# EAGLE design expander8 (EAGLE 6.1)
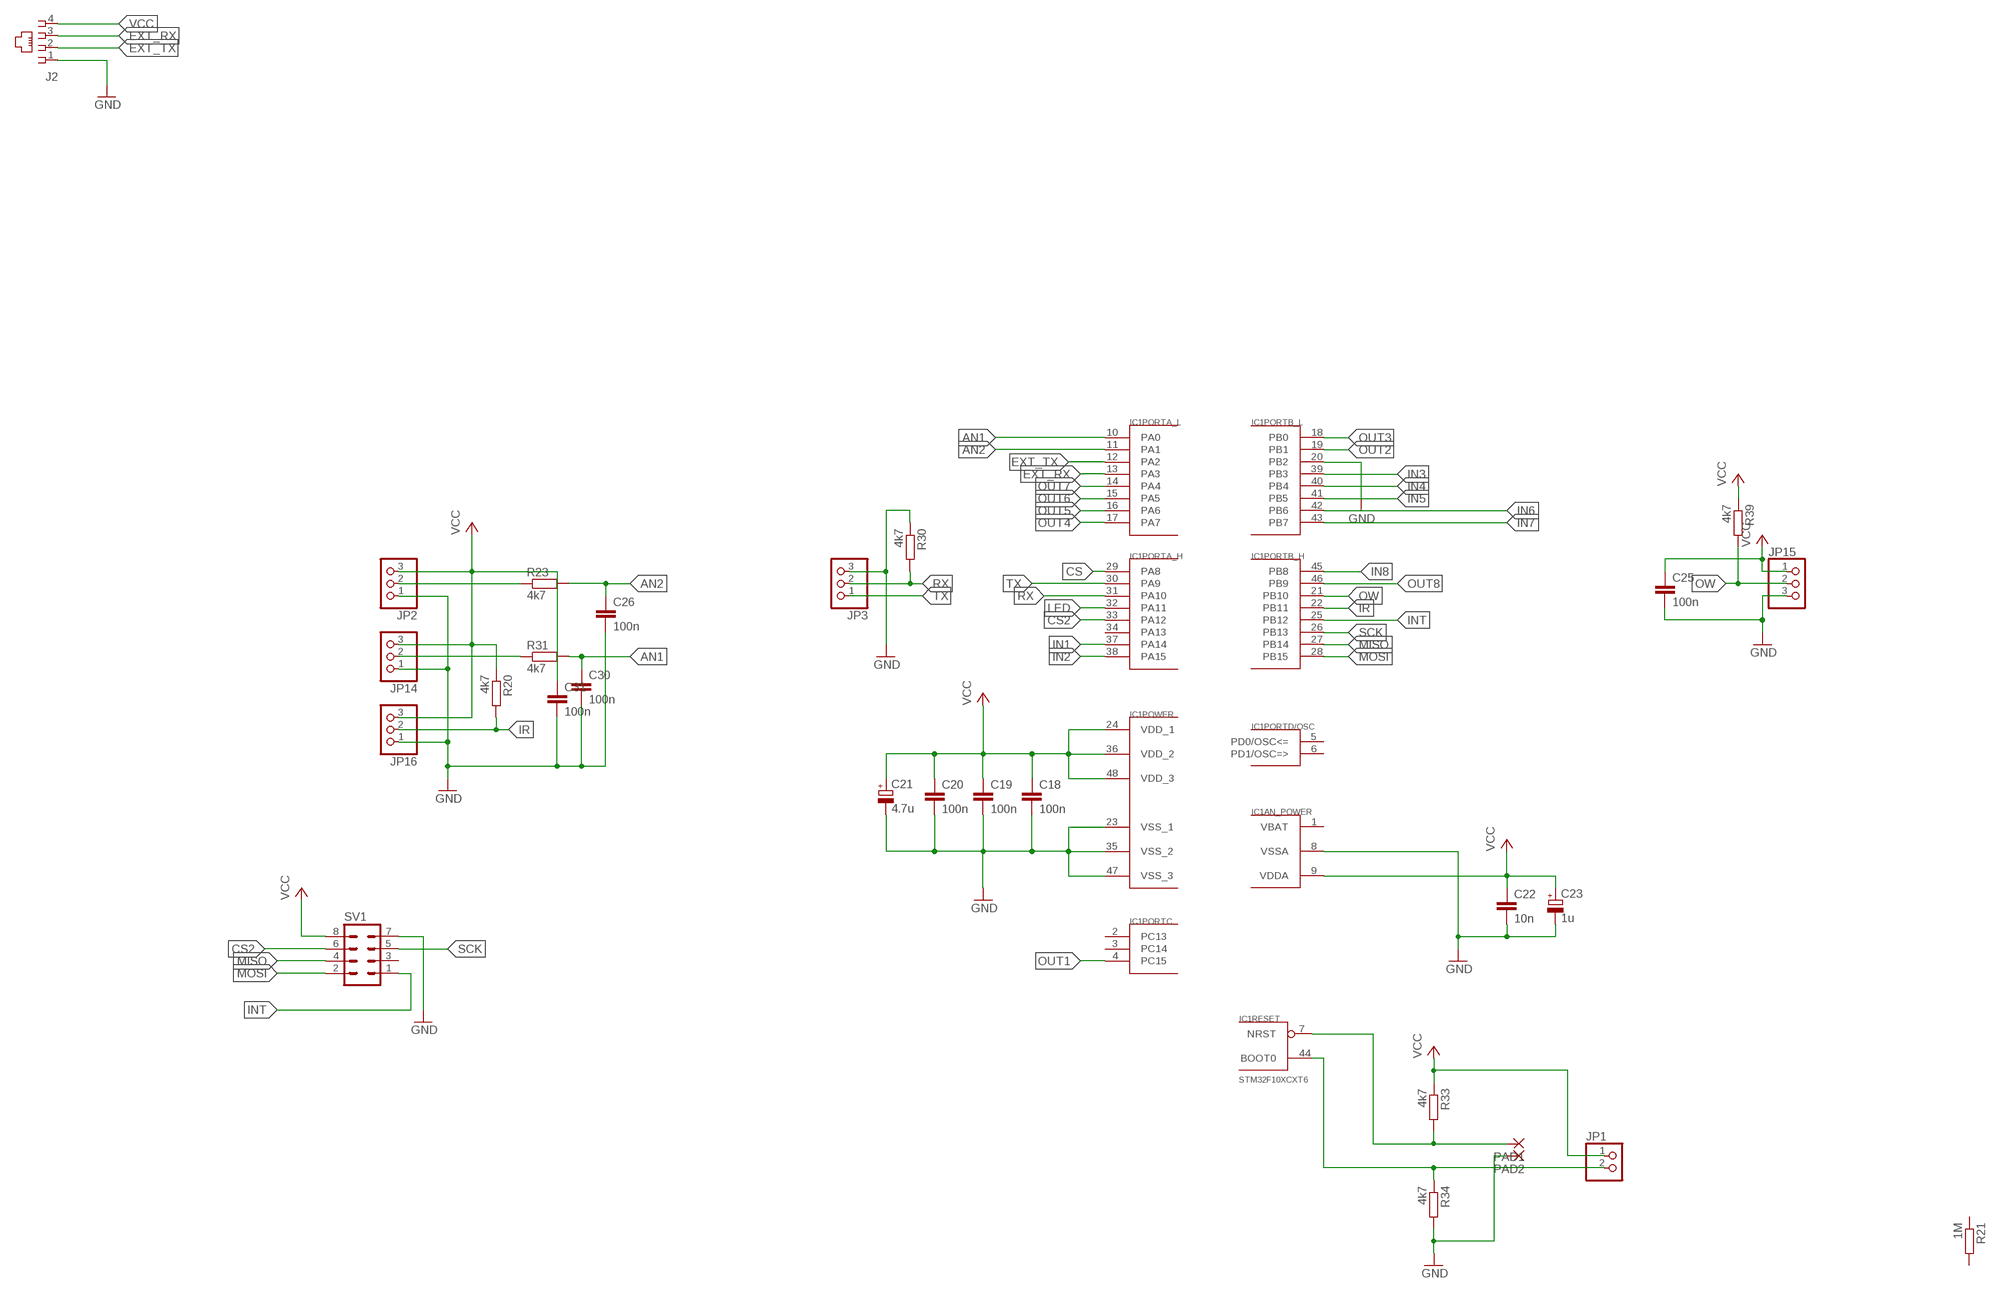
[diagram p0: schematic, sheet 1, part 1 of 3]
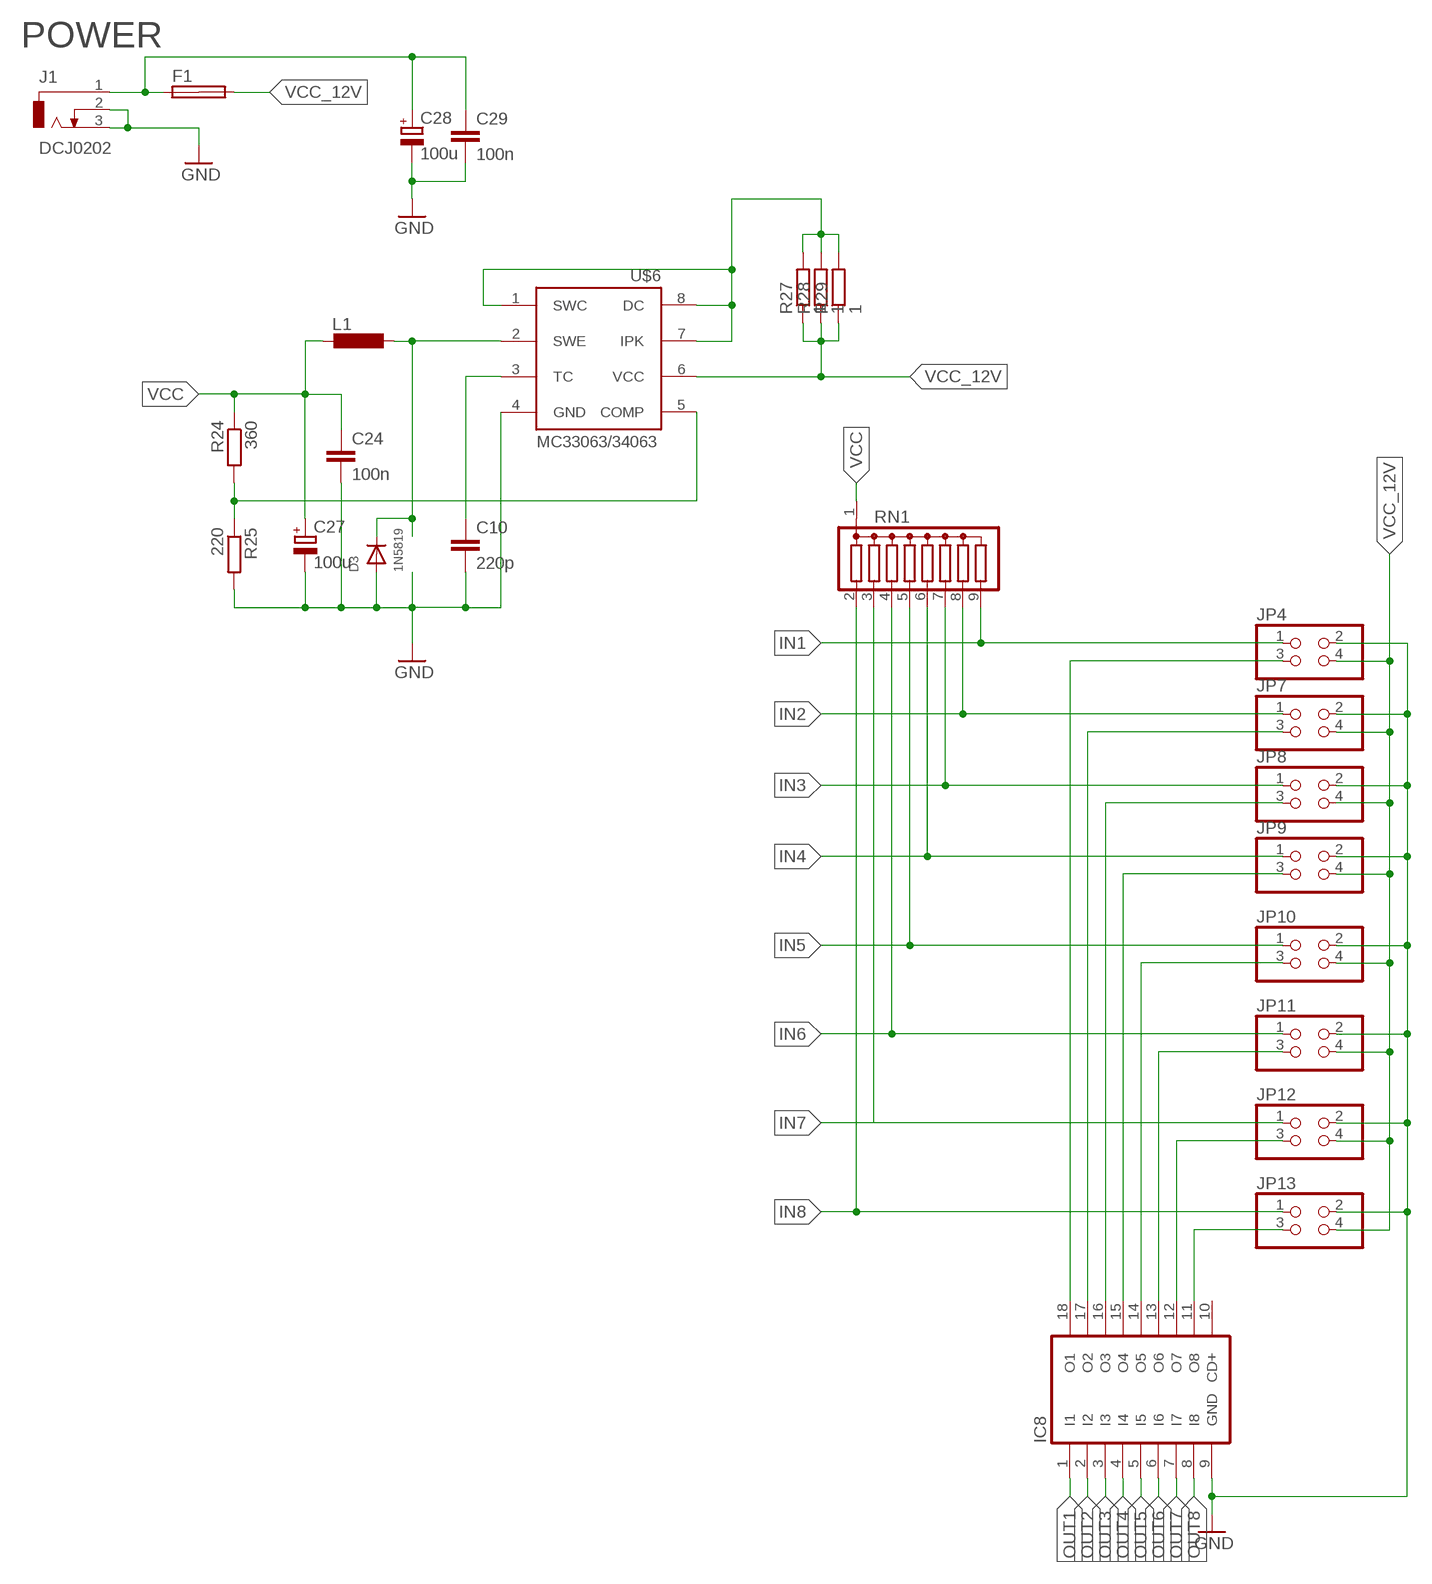
[diagram p1: schematic, sheet 1, part 2 of 3]
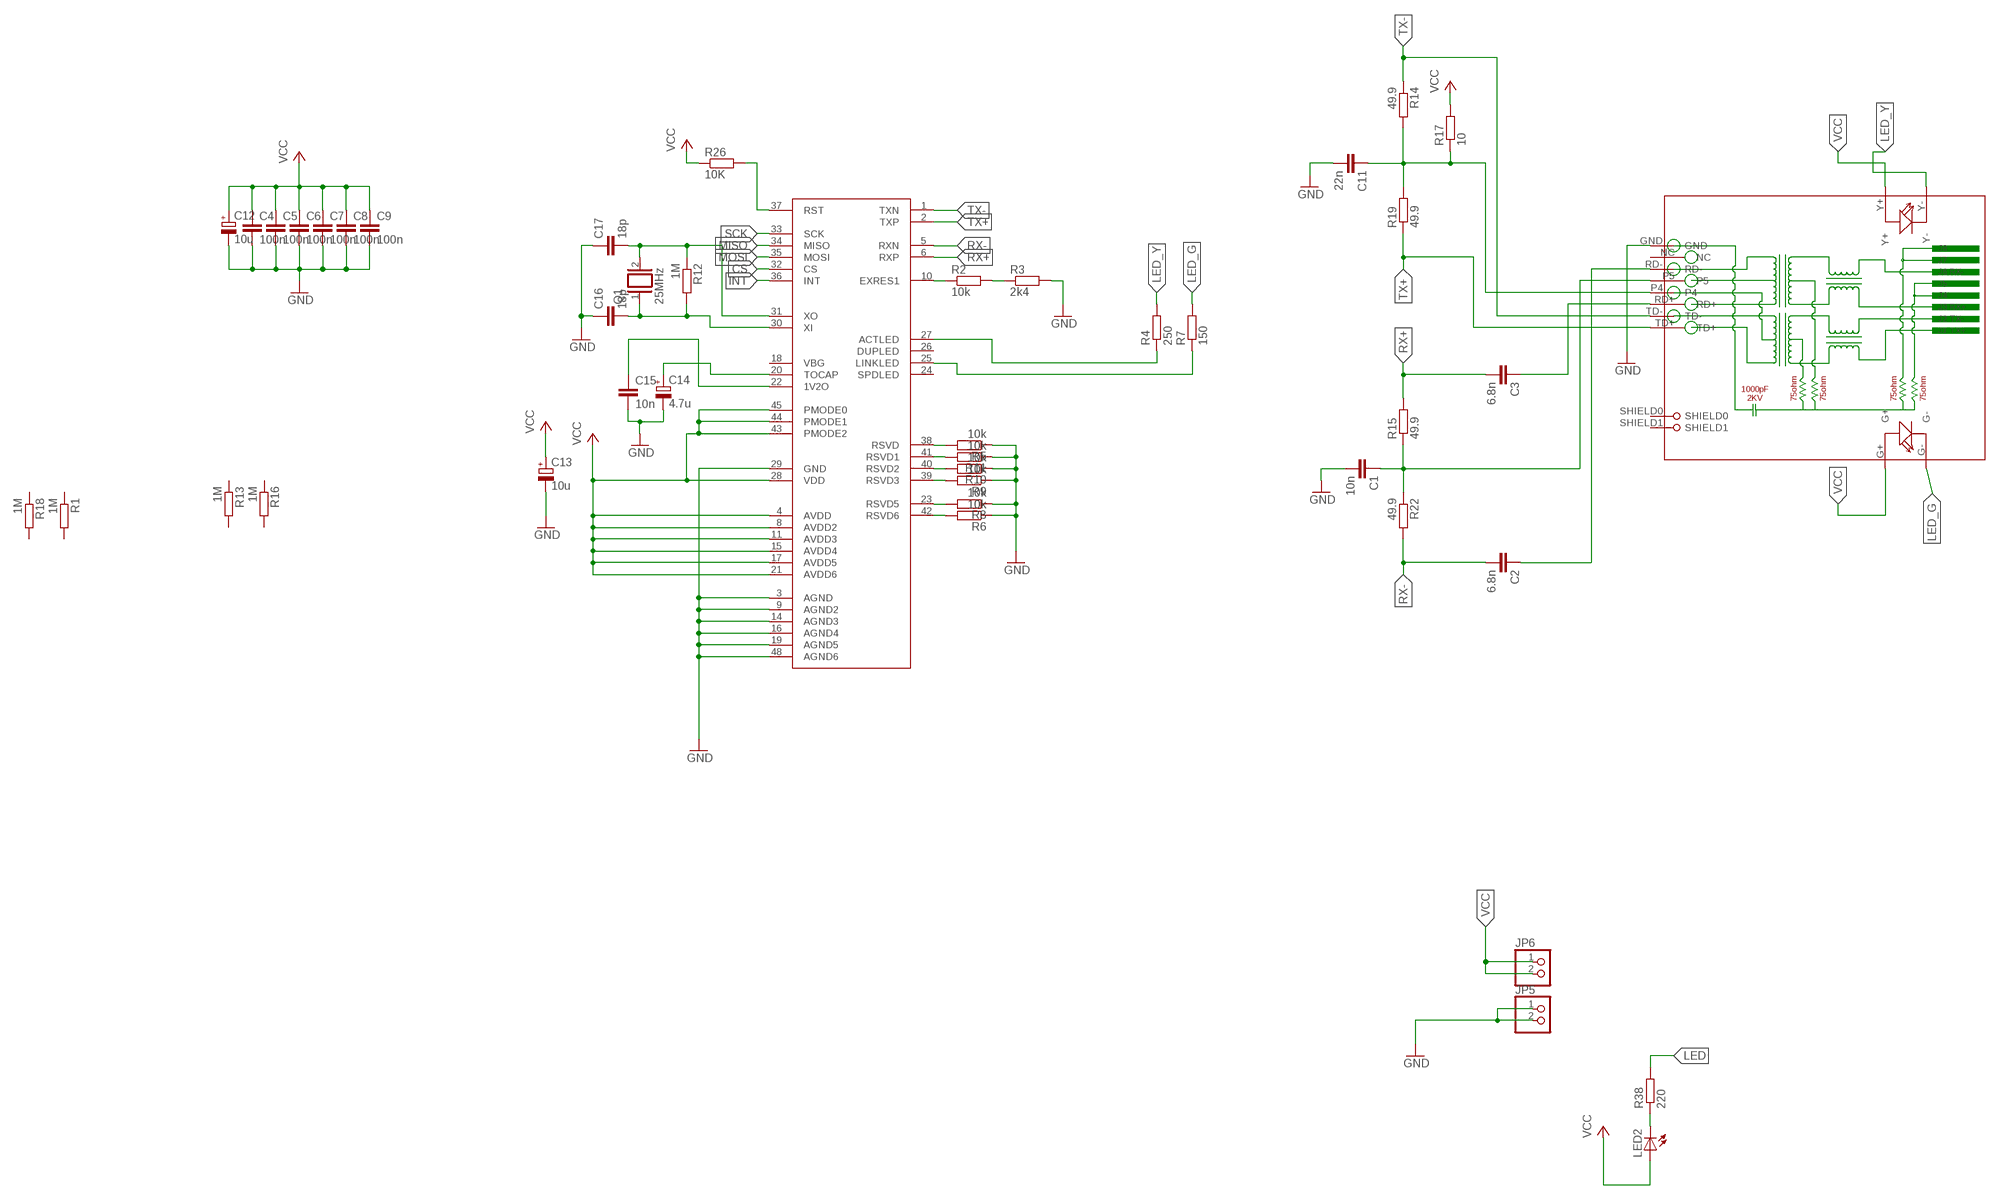
[diagram p2: schematic, sheet 1, part 3 of 3]

## Parts
C1  10n  C-EUC0805  [C0805]
C2  6.8n  C-EUC0805  [C0805]
C3  6.8n  C-EUC0805  [C0805]
C4  100n  C-EUC0805  [C0805]
C5  100n  C-EUC0805  [C0805]
C6  100n  C-EUC0805  [C0805]
C7  100n  C-EUC0805  [C0805]
C8  100n  C-EUC0805  [C0805]
C9  100n  C-EUC0805  [C0805]
C10  220p  C-EUC0805  [C0805]
C11  22n  C-EUC0805  [C0805]
C12  10u  CPOL-EUE2.5-5  [E2,5-5]
C13  10u  CPOL-EUE2.5-5  [E2,5-5]
C14  4.7u  CPOL-EUE2.5-5  [E2,5-5]
C15  10n  C-EUC1206  [C1206]
C16  18p  C-EUC0805  [C0805]
C17  18p  C-EUC0805  [C0805]
C18  100n  C-EUC0805  [C0805]
C19  100n  C-EUC0805  [C0805]
C20  100n  C-EUC0805  [C0805]
C21  4.7u  CPOL-EUE2.5-5  [E2,5-5]
C22  10n  C-EUC0805  [C0805]
C23  1u  CPOL-EUE2.5-5  [E2,5-5]
C24  100n  C-EUC0805  [C0805]
C25  100n  C-EUC1206  [C1206]
C26  100n  C-EUC0805  [C0805]
C27  100u  CPOL-EUE2.5-7  [E2,5-7]
C28  100u  CPOL-EUE2.5-7  [E2,5-7]
C29  100n  C-EUC0805  [C0805]
C30  100n  C-EUC1206  [C1206]
C31  100n  C-EUC0805  [C0805]
D3  1N5819  DIODESMA  [SMADIODE]
F1  SHK20L  [SHK20L]
IC1  STM32F10XCXT6  [TQFP48]
IC8  ULN2803AD  [SO18W]
J1  DCJ0202  [DCJ0202]
J2  520250-2  [520250-2]
JP1  PINHD-1X2  [1X02]
JP2  PINHD-1X3  [1X03]
JP3  PINHD-1X3  [1X03]
JP4  PINHD-2X2/90  [2X02/90]
JP5  PINHD-1X2  [1X02]
JP6  PINHD-1X2  [1X02]
JP7  PINHD-2X2/90  [2X02/90]
JP8  PINHD-2X2/90  [2X02/90]
JP9  PINHD-2X2/90  [2X02/90]
JP10  PINHD-2X2/90  [2X02/90]
JP11  PINHD-2X2/90  [2X02/90]
JP12  PINHD-2X2/90  [2X02/90]
JP13  PINHD-2X2/90  [2X02/90]
JP14  PINHD-1X3  [1X03]
JP15  PINHD-1X3  [1X03]
JP16  PINHD-1X3  [1X03]
L1  L-EU0207/2V  [0207/2V]
LED2  LEDCHIPLED_0805  [CHIPLED_0805]
PAD1  SMD2  [SMD1,27-2,54]
PAD2  SMD2  [SMD1,27-2,54]
Q1  25MHz  XTAL/S  [QS]
R1  1M  R-EU_R1206  [R1206]
R2  10k  R-EU_R0805  [R0805]
R3  2k4  R-EU_R0805  [R0805]
R4  250  R-EU_R1206  [R1206]
R5  10k  R-EU_R0603  [R0603]
R6  10k  R-EU_R0603  [R0603]
R7  150  R-EU_R1206  [R1206]
R8  10k  R-EU_R0805  [R0805]
R9  10k  R-EU_R0603  [R0603]
R10  10k  R-EU_R0603  [R0603]
R11  10k  R-EU_R0603  [R0603]
R12  1M  R-EU_R0805  [R0805]
R13  1M  R-EU_R1206  [R1206]
R14  49.9  R-EU_R0805  [R0805]
R15  49.9  R-EU_R1206  [R1206]
R16  1M  R-EU_R1206  [R1206]
R17  10  R-EU_R0805  [R0805]
R18  1M  R-EU_R1206  [R1206]
R19  49.9  R-EU_R1206  [R1206]
R20  4k7  R-EU_R0805  [R0805]
R21  1M  R-EU_R1206  [R1206]
R22  49.9  R-EU_R0805  [R0805]
R23  4k7  R-EU_R0805  [R0805]
R24  360  R-EU_M1206  [M1206]
R25  220  R-EU_M1206  [M1206]
R26  10K  R-EU_R0805  [R0805]
R27  1  R-EU_R1206  [R1206]
R28  1  R-EU_R1206  [R1206]
R29  1  R-EU_R1206  [R1206]
R30  4k7  R-EU_R1206  [R1206]
R31  4k7  R-EU_R0805  [R0805]
R33  4k7  R-EU_R0805  [R0805]
R34  4k7  R-EU_R1206  [R1206]
R38  220  R-EU_R0805  [R0805]
R39  4k7  R-EU_R0805  [R0805]
RJ1  HR911105A  [HR911105A]
RN1  G08R  [SIL9]
SV1  MA04-2  [MA04-2]
U$1  W5500  [TQFP48]
U$6  MC33063/MC34063D  [SO08]

## Nets
AN1: C30.1 IC1.10(PORTA_L:PA0) R31.2
AN2: C26.1 IC1.11(PORTA_L:PA1) R23.2
COMP: R24.2 R25.1 U$6.5(COMP)
CS: IC1.29(PORTA_H:PA8) U$1.32(CS)
CS2: IC1.33(PORTA_H:PA12) SV1.6
EXT_RX: IC1.13(PORTA_L:PA3) J2.3
EXT_TX: IC1.12(PORTA_L:PA2) J2.2
GND: C1.2 C4.2 C5.2 C6.2 C7.2 C8.2 C9.2 C10.2 C11.2 C12.- C13.- C14.- C15.2 C16.1 C17.1 C18.2 C19.2 C20.2 C21.- C22.2 C23.- C24.2 C25.2 C26.2 C27.- C28.- C29.2 C30.2 C31.2 D3.A IC1.8(AN_POWER:VSSA) IC1.20(PORTB_L:PB2) IC1.23(POWER:VSS_1) IC1.35(POWER:VSS_2) IC1.47(POWER:VSS_3) IC8.9(GND) J1.2 J1.3 J2.1 JP2.1 JP3.3 JP4.2 JP5.1 JP5.2 JP7.2 JP8.2 JP9.2 JP10.2 JP11.2 JP12.2 JP13.2 JP14.1 JP15.3 JP16.1 PAD2.1(P) R3.2 R5.1 R6.1 R8.1 R9.1 R10.1 R11.1 R25.2 R30.1 R34.2 RJ1.GND SV1.7 U$1.3(AGND) U$1.9(AGND2) U$1.14(AGND3) U$1.16(AGND4) U$1.19(AGND5) U$1.29(GND) U$1.48(AGND6) U$6.4(GND)
IN1: IC1.37(PORTA_H:PA14) JP4.1 RN1.9
IN2: IC1.38(PORTA_H:PA15) JP7.1 RN1.8
IN3: IC1.39(PORTB_L:PB3) JP8.1 RN1.7
IN4: IC1.40(PORTB_L:PB4) JP9.1 RN1.6
IN5: IC1.41(PORTB_L:PB5) JP10.1 RN1.5
IN6: IC1.42(PORTB_L:PB6) JP11.1 RN1.4
IN7: IC1.43(PORTB_L:PB7) JP12.1 RN1.3
IN8: IC1.45(PORTB_H:PB8) JP13.1 RN1.2
INT: IC1.25(PORTB_H:PB12) SV1.1 U$1.36(INT)
IPK: R27.2 R28.2 R29.2 U$6.1(SWC) U$6.7(IPK) U$6.8(DC)
IR: IC1.22(PORTB_H:PB11) JP16.2 R20.2
LED: IC1.32(PORTA_H:PA11) R38.2
LED_G: R7.2 RJ1.G-
LED_Y: R4.2 RJ1.Y-
MISO: IC1.27(PORTB_H:PB14) SV1.4 U$1.34(MISO)
MOSI: IC1.28(PORTB_H:PB15) SV1.2 U$1.35(MOSI)
N$1: C3.1 RJ1.RD+
N$2: C2.1 RJ1.RD-
N$3: IC8.18(O1) JP4.3
N$5: IC8.17(O2) JP7.3
N$6: R2.1 U$1.10(EXRES1)
N$7: R2.2 R3.1
N$8: C15.1 U$1.22(1V2O)
N$9: C14.+ U$1.20(TOCAP)
N$10: C17.2 Q1.2 R12.1 U$1.31(XO)
N$11: IC8.16(O3) JP8.3
N$12: R5.2 U$1.38(RSVD)
N$13: IC8.15(O4) JP9.3
N$14: R4.1 U$1.27(ACTLED)
N$15: R11.2 U$1.41(RSVD1)
N$16: R10.2 U$1.40(RSVD2)
N$17: R7.1 U$1.25(LINKLED)
N$18: R9.2 U$1.39(RSVD3)
N$19: R8.2 U$1.23(RSVD5)
N$20: R6.2 U$1.42(RSVD6)
N$21: C16.2 Q1.1 R12.2 U$1.30(XI)
N$23: IC8.14(O5) JP10.3
N$24: IC8.13(O6) JP11.3
N$25: IC8.12(O7) JP12.3
N$26: LED2.C R38.1
N$28: R26.2 U$1.37(RST)
N$29: IC8.11(O8) JP13.3
N$31: JP2.2 R23.1
N$32: JP14.2 R31.1
N$49: C11.1 R14.2 R17.1 R19.2 RJ1.P4
N$51: D3.C L1.1 U$6.2(SWE)
N$56: C10.1 U$6.3(TC)
N$57: C28.+ C29.1 F1.1A J1.1
N$64: IC1.44(RESET:BOOT0) JP1.2 R34.1
N$66: C1.1 R15.1 R22.1 RJ1.P5
OUT1: IC1.4(PORTC:PC15) IC8.1(I1)
OUT2: IC1.19(PORTB_L:PB1) IC8.2(I2)
OUT3: IC1.18(PORTB_L:PB0) IC8.3(I3)
OUT4: IC1.17(PORTA_L:PA7) IC8.4(I4)
OUT5: IC1.16(PORTA_L:PA6) IC8.5(I5)
OUT6: IC1.15(PORTA_L:PA5) IC8.6(I6)
OUT7: IC1.14(PORTA_L:PA4) IC8.7(I7)
OUT8: IC1.46(PORTB_H:PB9) IC8.8(I8)
OW: IC1.21(PORTB_H:PB10) JP15.2 R39.2
RST1: IC1.7(RESET:NRST) PAD1.1(P) R33.2
RX: IC1.31(PORTA_H:PA10) JP3.2 R30.2
RX+: C3.2 R15.2 U$1.6(RXP)
RX-: C2.2 R22.2 U$1.5(RXN)
SCK: IC1.26(PORTB_H:PB13) SV1.5 U$1.33(SCK)
TX: IC1.30(PORTA_H:PA9) JP3.1
TX+: R19.1 RJ1.TD+ U$1.2(TXP)
TX-: R14.1 RJ1.TD- U$1.1(TXN)
VCC: C4.1 C5.1 C6.1 C7.1 C8.1 C9.1 C12.+ C13.+ C18.1 C19.1 C20.1 C21.+ C22.1 C23.+ C24.1 C25.1 C27.+ C31.1 IC1.9(AN_POWER:VDDA) IC1.24(POWER:VDD_1) IC1.36(POWER:VDD_2) IC1.48(POWER:VDD_3) J2.4 JP1.1 JP2.3 JP6.1 JP6.2 JP14.3 JP15.1 JP16.3 L1.2 LED2.A R17.2 R20.1 R24.1 R26.1 R33.1 R39.1 RJ1.G+ RJ1.Y+ RN1.1 SV1.8 U$1.4(AVDD) U$1.8(AVDD2) U$1.11(AVDD3) U$1.15(AVDD4) U$1.17(AVDD5) U$1.21(AVDD6) U$1.28(VDD) U$1.43(PMODE2) U$1.44(PMODE1) U$1.45(PMODE0)
VCC_12V: F1.2A JP4.4 JP7.4 JP8.4 JP9.4 JP10.4 JP11.4 JP12.4 JP13.4 R27.1 R28.1 R29.1 U$6.6(VCC)
Unconnected: F1.1B F1.2B IC1.2(PORTC:PC13) IC1.3(PORTC:PC14) IC1.5(PORTD/OSC:PD0/OSC<=) IC1.6(PORTD/OSC:PD1/OSC=>) IC1.34(PORTA_H:PA13) IC8.10(CD+) R1.1 R1.2 R13.1 R13.2 R16.1 R16.2 R18.1 R18.2 R21.1 R21.2 RJ1.NC RJ1.SHIELD0 RJ1.SHIELD1 SV1.3 U$1.18(VBG) U$1.24(SPDLED) U$1.26(DUPLED)

## Notes on the sheet
- POWER

## Power pins joined to a net without a drawn wire
VBAT: IC1.1(AN_POWER:VBAT)

## Library data of the parts
C1-C3 C11 C25 = resistor:C-EU: CAPACITOR, European symbol
C4-C10 C15-C20 C22 C24 C26 C29-C31 = rcl-kd:C-EU: CAPACITOR, European symbol
C12-C14 C21 C23 C27 C28 = rcl-kd:CPOL-EU: POLARIZED CAPACITOR, European symbol
D3 = adafruit:DIODE: Diode SMADIODE - SMA Surface Mount Package 20V 1A Schottky Diode Digikey: 641-1014-6-ND DO-1N4148 - Through Hole Small Current Diode SOD-123 20V 1 A (.5mV Vf) Schottky Diode - Digikey: MBRX120TPMSCT-ND SOD-323 10V 570mA (.38mV Vf, 3ns) Schottky Diode - Digikey: ZLLS410CT-ND SOD-523 30V 30mA Schottky Diode (RB751S-40TE61) - Digikey: RB751S-40TE61CT-ND SOT23-R/W - SOT23 Package (R = Solder Paste/Reflow Ovens, W = Hand-Soldering) BAT54Film 40V 300mA - Digikey: 497-7162-1-ND
F1 = fuse:SHK20L: FUSE HOLDER 5 x 20 mm, SH contact, SHH1 Schukat, E1073 Buerklin; OC_FARNELL: unknown; OC_NEWARK: unknown
IC1 = stm32:STM32F10XCXT6: ST STM32F101/103 48pin LQFP
IC8 = uln-udn:ULN2803A: DRIVER ARRAY
J1 = con-jack:DCJ0202: DC POWER JACK Source: DCJ0202.pdf; OC_FARNELL: unknown; OC_NEWARK: unknown
J2 = con-amp:520250-2: AMP connector
JP1 JP5 JP6 = pinhead-kd:PINHD-1X2: PIN HEADER
JP2 JP3 JP14-JP16 = pinhead:PINHD-1X3: PIN HEADER
JP4 JP7-JP13 = pinhead-kd:PINHD-2X2: PIN HEADER
L1 = rcl-kd:L-EU: INDUCTOR, European symbol
LED2 = adafruit:LED: LED OSRAM: - CHIPLED LG R971, LG N971, LY N971, LG Q971, LY Q971, LO R971, LY R971 LH N974, LH R974 LS Q976, LO Q976, LY Q976 LO Q996 - Hyper CHIPLED LW Q18S LB Q993, LB Q99A, LB R99A - SideLED LS A670, LO A670, LY A670, LG A670, LP A670 LB A673, LV A673, LT A673, LW A673 LH A674 LY A675 LS A676, LA A676, LO A676, LY A676, LW A676 LS A679, LY A679, LG A679 - Hyper Micro SIDELED® LS Y876, LA Y876, LO Y876, LY Y876 LT Y87S - SmartLED LW L88C, LW L88S LB L89C, LB L89S, LG L890 LS L89K, LO L89K, LY L89K LS L896, LA L896, LO L896, LY L896 - TOPLED LS T670, LO T670, LY T670, LG T670, LP T670 LSG T670, LSP T670, LSY T670, LOP T670, LYG T670 LG T671, LOG T671, LSG T671 LB T673, LV T673, LT T673, LW T673 LH T674 LS T676, LA T676, LO T676, LY T676, LB T676, LH T676, LSB T676, LW T676 LB T67C, LV T67C, LT T67C, LS T67K, LO T67K, LY T67K, LW E67C LS E67B, LA E67B, LO E67B, LY E67B, LB E67C, LV E67C, LT E67C LW T67C LS T679, LY T679, LG T679 LS T770, LO T770, LY T770, LG T770, LP T770 LB T773, LV T773, LT T773, LW T773 LH T774 LS E675, LA E675, LY E675, LS T675 LS T776, LA T776, LO T776, LY T776, LB T776 LHGB T686 LT T68C, LB T68C - Hyper Mini TOPLED® LB M676 - Mini TOPLED Santana® LG M470 LS M47K, LO M47K, LY M47K Source: http://www.osram.convergy.de/
PAD1 PAD2 = wirepad:SMD2: SMD PAD
Q1 = special:XTAL/S: CRYSTAL
R1-R13 R16 R18 R21 R26-R29 R33 R34 = rcl-kd:R-EU_: RESISTOR, European symbol
R14 R15 R17 R19 R20 R22 R23 R30 R31 R38 R39 = resistor:R-EU_: RESISTOR, European symbol
R24 R25 = rcl:R-EU_: RESISTOR, European symbol
RJ1 = CONNECTER:HR911105A
RN1 = resistor-sil:G08R: SIL RESISTOR; OC_FARNELL: unknown; OC_NEWARK: unknown
SV1 = con-lstb-kd:MA04-2: PIN HEADER; OC_FARNELL: unknown; OC_NEWARK: unknown
U$1 = wiznet:W5500
U$6 = adafruit:MC33063/MC34063: MC33063 and MC34063 Basic DC/DC converter with internal power-NPN transistor, 100KHz, 1.5A peak switch current. 3-40 input/output.

## Board
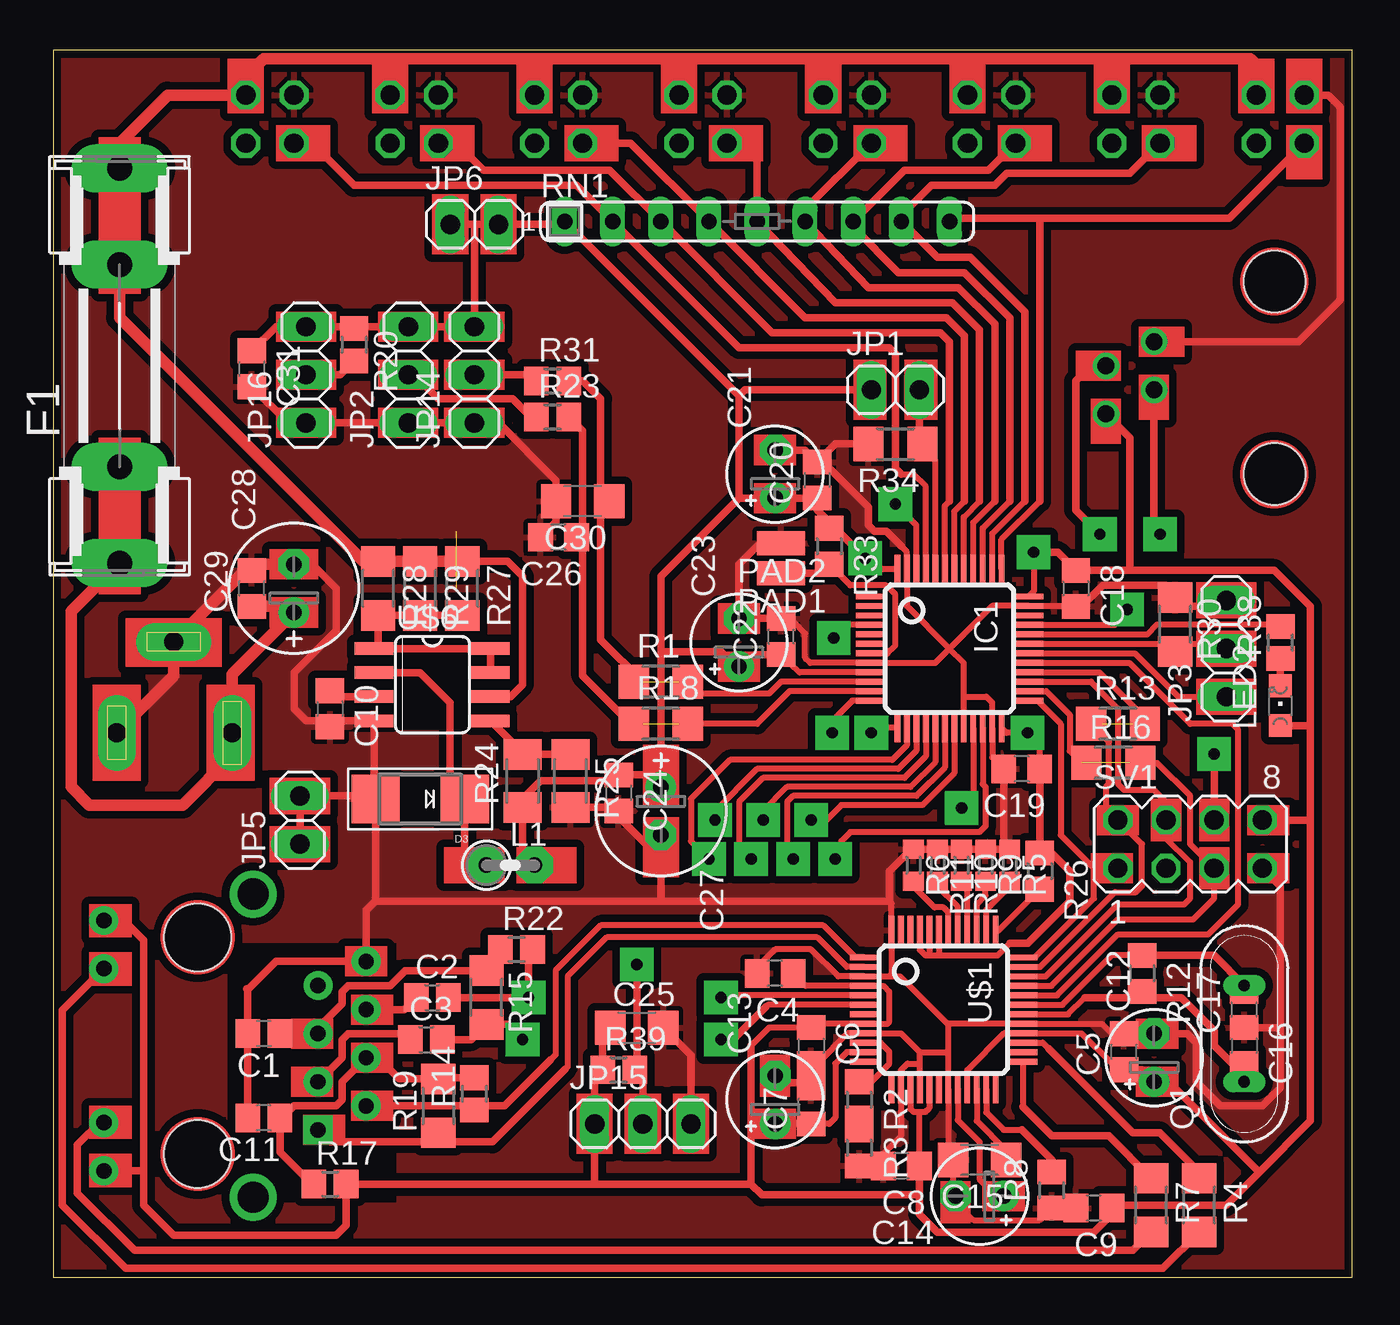
[diagram p3: board, top side]
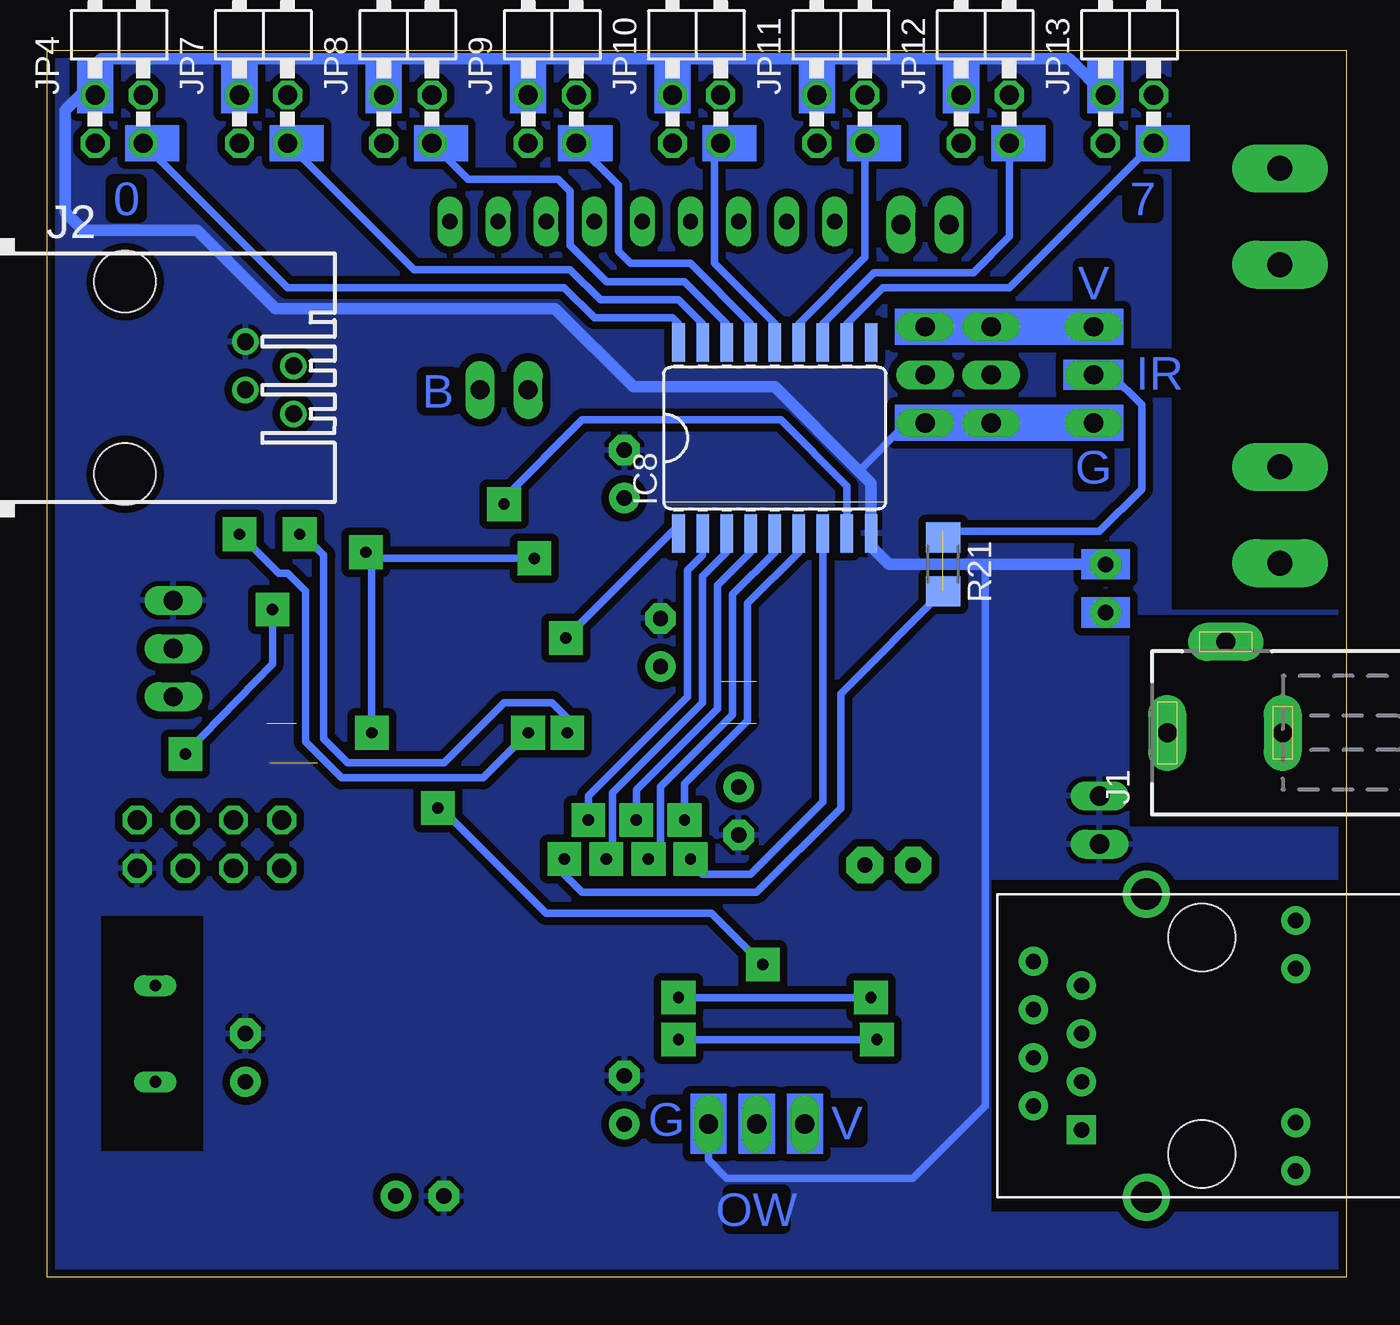
[diagram p4: board, bottom side, seen from below]

Size 68.56 x 64.76 mm. Coordinates in mm from the lower left corner, seen from the top.
Outline: 0,0 68.56,0 68.56,64.76 0,64.76 0,0
Copper layers (1*16): Top 0.035mm / dielectric 1.5mm / Bottom 0.035mm
Design rules: minimum track width 10mil, minimum drill 12mil, track to track 4mil, track to pad 4mil, pad to pad 4mil, via to via 4mil, smd to smd 4mil, copper to edge 10mil, drill to drill 8mil, minimum pad ring 10mil, minimum via ring 8mil, stop-mask expansion 4mil, vias tented up to drill 0mil, thermal gap 10mil

### Footprints (pad centres in the part's own frame; a part is rotated, then mirrored left to right if it is on the bottom)
C0805 = smd 1.3 x 1.5: 1 -0.85,0; 2 0.85,0
C0805' = smd 1.3 x 1.5: 1 -0.95,0; 2 0.95,0
E2,5-5 = drill 0.813 pad 1.6: + -1.27,0 | drill 0.813 pad 1.6 octagon: - 1.27,0
C1206 = smd 1.6 x 1.8: 1 -1.4,0; 2 1.4,0
E2,5-7 = drill 0.813 pad 1.6: + -1.27,0 | drill 0.813 pad 1.6 octagon: - 1.27,0
SMADIODE = smd 2.54 x 2.54: A 2.349,0; C -2.349,0
SHK20L = drill 1.321 pad 2.54 long: 1A -10.414,0; 1B -5.334,0; 2A 10.414,0; 2B 5.334,0
TQFP48 = smd 0.305 x 1.524: 1 -2.75,-4.183; 2 -2.25,-4.183; 3 -1.75,-4.183; 4 -1.25,-4.183; 5 -0.75,-4.183; 6 -0.25,-4.183; 7 0.25,-4.183; 8 0.75,-4.183; 9 1.25,-4.183; 10 1.75,-4.183; 11 2.25,-4.183; 12 2.75,-4.183; 25 2.75,4.183; 26 2.25,4.183; 27 1.75,4.183; 28 1.25,4.183; 29 0.75,4.183; 30 0.25,4.183; 31 -0.25,4.183; 32 -0.75,4.183; 33 -1.25,4.183; 34 -1.75,4.183; 35 -2.25,4.183; 36 -2.75,4.183 | smd 1.524 x 0.305: 13 4.183,-2.75; 14 4.183,-2.25; 15 4.183,-1.75; 16 4.183,-1.25; 17 4.183,-0.75; 18 4.183,-0.25; 19 4.183,0.25; 20 4.183,0.75; 21 4.183,1.25; 22 4.183,1.75; 23 4.183,2.25; 24 4.183,2.75; 37 -4.183,2.75; 38 -4.183,2.25; 39 -4.183,1.75; 40 -4.183,1.25; 41 -4.183,0.75; 42 -4.183,0.25; 43 -4.183,-0.25; 44 -4.183,-0.75; 45 -4.183,-1.25; 46 -4.183,-1.75; 47 -4.183,-2.25; 48 -4.183,-2.75
SO18W = smd 0.66 x 2.032: 1 -5.08,-5.029; 2 -3.81,-5.029; 3 -2.54,-5.029; 4 -1.27,-5.029; 5 0,-5.029; 6 1.27,-5.029; 7 2.54,-5.029; 8 3.81,-5.029; 9 5.08,-5.029; 10 5.08,5.029; 11 3.81,5.029; 12 2.54,5.029; 13 1.27,5.029; 14 0,5.029; 15 -1.27,5.029; 16 -2.54,5.029; 17 -3.81,5.029; 18 -5.08,5.029
DCJ0202 = drill 1 pad 2 long: 1 0,3.1; 2 4.8,0; 3 0,-3
520250-2 = drill 0.889: 1 -1.905,6.35; 2 -0.635,8.89; 3 0.635,6.35; 4 1.905,8.89 | hole 3.251: -5.08,0; 5.08,0
1X02 = drill 1.016 long: 1 -1.27,0; 2 1.27,0
1X03 = drill 1.016 long: 1 -2.54,0; 2 0,0; 3 2.54,0
2X02/90 = drill 1.016 octagon: 1 -1.27,-6.35; 2 -1.27,-3.81; 3 1.27,-6.35; 4 1.27,-3.81
0207/2V = drill 0.813 pad 1.93 octagon: 1 -1.27,0; 2 1.27,0
CHIPLED_0805 = smd 1.2 x 1.2: A 0,-1.05; C 0,1.05
SMD1,27-2,54 = smd 1.27 x 2.54: 1 0,0
QS = drill 0.61 long: 1 -2.54,0; 2 2.54,0
R1206 = smd 1.6 x 1.803: 1 -1.422,0; 2 1.422,0
R0805 = smd 1.3 x 1.5: 1 -0.95,0; 2 0.95,0
R0603 = smd 1 x 1.1: 1 -0.85,0; 2 0.85,0
R0805' = smd 1.3 x 1.5: 1 -0.85,0; 2 0.85,0
M1206 = smd 1.6 x 2: 1 -1.4,0; 2 1.4,0
HR911105A = drill 0.813 pad 1.524: G+ 4.953,-6.604; G- 4.953,-4.064; GND -8.89,4.445; NC -6.35,3.175; P4 -8.89,-0.635; P5 -6.35,0.635; RD+ -6.35,-1.905; RD- -8.89,1.905; TD- -8.89,-3.175; Y+ 4.953,6.604; Y- 4.953,4.064 | drill 1.651 pad 2.159: SHIELD0 -2.921,8.001; SHIELD1 -2.921,-8.001 | drill 0.813 pad 1.524 square: TD+ -6.35,-4.445 | hole 3.556: 0,-5.715; 0,5.715
SIL9 = drill 0.813 long: 1 -10.16,0; 2 -7.62,0; 3 -5.08,0; 4 -2.54,0; 5 0,0; 6 2.54,0; 7 5.08,0; 8 7.62,0; 9 10.16,0
MA04-2 = drill 1.016 octagon: 1 -3.81,-1.27; 2 -3.81,1.27; 3 -1.27,-1.27; 4 -1.27,1.27; 5 1.27,-1.27; 6 1.27,1.27; 7 3.81,-1.27; 8 3.81,1.27
SO08 = smd 0.66 x 2.032: 1 -1.905,-3.073; 2 -0.635,-3.073; 3 0.635,-3.073; 4 1.905,-3.073; 5 1.905,3.073; 6 0.635,3.073; 7 -0.635,3.073; 8 -1.905,3.073

### Placement (x,y rotation side)
C1  11.11,12.86 180 top
C2  20,14.76 0 top
C3  19.68,12.54 0 top
C4  100n  [C0805']  38.1,16.03 180 top
C5  100n  [C0805']  56.52,11.91 90 top
C6  100n  [C0805']  40.01,12.22 270 top
C7  100n  [C0805']  40.01,9.05 90 top
C8  100n  [C0805']  44.77,5.87 180 top
C9  100n  [C0805']  54.93,3.65 180 top
C10  220p  [C0805']  14.61,30 270 top
C11  11.11,8.41 180 top
C12  58.1,11.59 90 top
C13  38.1,9.37 90 top
C14  48.9,4.29 180 top
C15  48.9,6.19 180 top
C16  18p  [C0805']  62.87,12.22 270 top
C17  18p  [C0805']  62.87,14.13 90 top
C18  100n  [C0805']  53.98,36.35 270 top
C19  100n  [C0805']  51.12,26.83 180 top
C20  100n  [C0805']  40.32,42.07 90 top
C21  38.1,42.39 90 top
C22  10n  [C0805']  38.42,33.81 90 top
C23  36.2,33.5 90 top
C24  100n  [C0805']  29.84,25.56 270 top
C25  30.8,13.18 0 top
C26  100n  [C0805']  26.67,39.05 180 top
C27  32.07,24.61 270 top
C28  12.7,36.35 90 top
C29  100n  [C0805']  10.48,36.35 90 top
C30  27.94,40.96 180 top
C31  100n  [C0805']  10.48,47.94 270 top
D3  19.37,25.24 180 top
F1  3.49,48.1 90 top
IC1  47.31,33.18 270 top
IC8  30.16,44.29 0 bottom
J1  6.35,28.73 90 bottom
J2  64.45,47.47 270 bottom
JP1  44.45,46.83 0 top
JP2  18.73,47.62 90 top
JP3  61.91,33.18 90 top
JP4  64.77,66.2 0 bottom
JP5  13.02,24.13 90 top
JP6  22.23,55.56 0 top
JP7  57.15,66.2 0 bottom
JP8  49.53,66.2 0 bottom
JP9  41.91,66.2 0 bottom
JP10  34.29,66.2 0 bottom
JP11  26.67,66.2 0 bottom
JP12  19.05,66.2 0 bottom
JP13  11.43,66.2 0 bottom
JP14  22.23,47.62 90 top
JP15  31.11,8.1 0 top
JP16  13.34,47.62 90 top
L1  24.13,21.75 0 top
LED2  64.77,30.16 0 top
PAD1  38.42,37.15 90 top
PAD2  38.42,38.73 90 top
Q1  62.87,12.86 90 top
R1  32.07,31.43 0 top
R2  42.55,9.37 270 top
R3  42.55,6.83 270 top
R4  60.48,3.81 270 top
R5  50.48,21.75 270 top
R6  45.4,21.75 270 top
R7  57.94,3.81 270 top
R8  52.7,4.6 90 top
R9  49.21,21.75 270 top
R10  47.94,21.75 270 top
R11  46.67,21.75 270 top
R12  57.47,16.03 270 top
R13  56.2,29.21 0 top
R14  49.9  [R0805']  22.23,9.68 90 top
R15  22.86,14.76 270 top
R16  55.96,27.15 0 top
R17  10  [R0805']  14.61,4.92 0 top
R18  32.07,29.21 0 top
R19  20.32,9.05 90 top
R20  4k7  [R0805']  15.88,49.21 270 top
R21  21.27,37.62 270 bottom
R22  49.9  [R0805']  24.45,17.3 0 top
R23  4k7  [R0805']  26.35,45.4 0 top
R24  24.77,26.19 90 top
R25  27.3,26.19 270 top
R26  52.07,21.43 270 top
R27  21.59,36.35 270 top
R28  17.14,36.35 270 top
R29  19.37,36.35 270 top
R30  59.21,34.45 270 top
R31  4k7  [R0805']  26.35,47.31 0 top
R33  40.96,38.58 270 top
R34  44.45,43.97 180 top
R38  220  [R0805']  64.77,33.5 90 top
R39  4k7  [R0805']  29.84,10.95 0 top
RJ1  7.62,12.22 0 bottom
RN1  37.15,55.72 0 top
SV1  60.01,22.86 0 top
U$1  46.99,14.13 270 top
U$6  20,31.27 270 top

### Tracks (layer width: path | path; a pad name or v marks a point on that pad's centre or on a via)
AN1  (1 unrouted)
  Top 0.305: IC1.10 38.41,31.43 37.78,30.8 33.66,30.8 33.02,31.43
  Top 0.406: 31.11,31.43 28.89,33.66 28.89,40.96 | C30.1 28.89,40.96 | 28.89,40.96 28.89,46.35 27.94,47.31 R31.2
AN2  (1 unrouted)
  Top 0.305: IC1.11 38.87,30.93 37.15,29.21 33.02,29.21
  Top 0.406: 31.11,29.21 30.48,29.21 27.94,31.75 27.94,39.05 | 27.94,39.05 27.94,44.66 R23.2 | C26.1 27.94,39.05
COMP
  Top 0.406: R25.1 R24.2 24.77,27.68 U$6.5
CS
  Top 0.305: U$1.32 52.98,14.88 56.2,18.1 60.96,18.1 62.55,19.68 62.55,28.89 62.23,29.21 60.01,29.21 56.79,32.43 IC1.29
CS2  (via drill 0.6 pad 1.78)
  Top 0.305: IC1.33 56.02,34.43 v56.67,35.24
  Top 0.406: v61.28,27.62 SV1.6
  Bottom 0.406: v61.28,27.62 56.67,32.38 v56.67,35.24
EXT_RX  (via drill 0.6 pad 1.78)
  Top 0.305: IC1.13 43.44,29 v43.18,28.73 | 58.1,47.15 J2.3
  Top 0.406: v58.42,39.21 58.1,39.53 58.1,47.15
  Bottom 0.406: v43.18,28.73 45.56,26.35 53.02,26.35 54.93,28.26 54.93,36.2 55.88,37.15 56.36,37.15 v58.42,39.21
EXT_TX  (via drill 0.6 pad 1.78)
  Top 0.305: IC1.12 42.18,30.43 41.12,29.37 v41.12,28.73
  Top 0.406: v55.24,39.21 53.98,40.48 53.98,47.31 54.61,47.94 J2.2
  Bottom 0.406: v41.12,28.73 41.12,29.53 41.91,30.32 44.45,30.32 47.62,27.15 52.7,27.15 53.98,28.42 53.98,38.1 54.93,39.05 v55.24,39.21
GND
  Top 0.305: 44.13,15.88 U$1.3 41.43,15.88 40.01,17.3 38.1,17.3 37.47,16.67 37.47,16.03 C4.2 | 47.2,13.38 U$1.29 55.36,13.38 55.88,12.86 C5.2 | 47.24,11.91 U$1.19 47.24,6.76 47.49,6.51 C15.2 47.49,4.8 47.66,4.64 48.01,4.29 48.01,3.59 48.58,3.02 52.07,3.02 R8.1 C9.2 | U$1.16 45.74,11.27 | 45.74,11.27 45.74,11.89 | 45.74,11.89 44.75,12.88 U$1.9 41.93,12.88 40.33,11.27 C6.2 C7.2 | 45.74,11.89 47.22,11.89 47.24,11.91 | 45.74,11.27 45.09,11.27 44.74,10.93 U$1.14 44.74,7.43 43.82,6.51 C8.2 43.81,5.56 R3.2 | 44.13,15.88 44.24,15.99 U$1.48 44.24,19.74 44.13,19.84 | 47.31,33.18 49.56,35.43 IC1.35 54.27,35.43 C18.2 | 47.31,33.18 45.06,35.43 IC1.47 45.06,38.29 44.77,38.58 | 47.31,33.18 46.56,32.43 IC1.8 39.96,32.43 39.69,32.7 39.69,33.97 39.05,34.61 38.73,34.61 C22.2 | IC1.20 48.06,30.59 | 48.06,30.59 48.1,30.64 49.24,30.64 49.56,30.32 IC1.23 49.56,27.44 C19.2 | 48.06,30.59 48.06,32.43 47.31,33.18 | 44.13,15.88 44.7,15.88 47.2,13.38 | 47.24,11.91 47.24,13.26 47.2,13.38
  Top 0.406: 10.26,15.18 11.75,16.67 RJ1.GND 16.51,19.37 17.02,19.88 | 10.26,15.18 C1.2 C11.2 | C7.2 39.31,10.26 38.1,10.26 C13.- | R5.1 49.85,22.6 | 49.85,22.6 R9.1 R10.1 R11.1 R6.1 45.3,22.6 44.13,21.43 44.13,19.84 32.07,19.84 | 32.07,19.84 17.05,19.84 17.02,19.88 | C5.2 C12.- 59.85,12.86 60.33,12.38 60.33,10.32 61.59,9.05 63.82,9.05 64.77,10 64.77,13.18 | 64.77,13.18 64.14,13.17 C16.1 C17.1 | C14.- 47.66,4.29 47.66,4.64 | C19.2 50.17,22.6 49.85,22.6 | JP3.3 61.6,35.4 59.37,35.4 59.21,35.56 R30.1 58.73,36.51 55.4,36.51 54.3,35.4 C18.2 | C22.2 C23.- 36.2,37.62 37.31,38.73 PAD2.1 | JP5.1 JP5.2 16.86,25.4 D3.A | C21.- 39.69,43.66 C20.2 | C20.2 40.65,43.02 43.03,40.64 43.03,39.68 43.34,39.37 43.97,39.37 44.77,38.58 | D3.A 16.93,25.33 U$6.4 14.61,29.37 | 27.3,24.61 R25.2 29.66,24.79 C24.2 29.84,24.29 32.07,22.07 | D3.A 17.02,19.88 | C10.2 14.61,29.37 | 14.61,29.37 13.34,29.37 12.7,30 12.7,31.91 14.92,34.13 14.92,36.35 13.65,37.62 C28.- | C27.- 32.07,22.07 | 32.07,22.07 32.07,19.84 | 10.44,37.62 10.44,37.34 C29.2 | J2.1 65.72,49.37 67.94,51.59 67.94,61.75 67.31,62.39 JP4.2 | JP15.3 33.66,11.72 C25.2 | 10.21,15.24 10.26,15.18 | R34.2 41.28,43.97 C20.2 | C26.2 26.54,39.87 C30.2 26.54,42.04 23.5,45.09 JP14.1 JP2.1 JP16.1 12.38,45.09 C31.2 | 64.77,13.18 64.77,20.64 SV1.7
  Top 0.61: J1.3 6.35,31.73 J1.2 10.44,37.62 C28.-
  Bottom 0.406: 25.08,38.58 25.03,39.21 IC8.9 | JP15.3 33.66,6.19 32.7,5.24 22.86,5.24 19.05,9.05 19.05,37.62 | 66.67,62.55 66.2,62.55 JP4.2 | 25.72,42.55 23.18,45.09 JP14.1 JP2.1 JP16.1
  Bottom 0.61: 25.08,38.58 24.13,37.62 19.05,37.62 C28.- | JP4.2 66.04,63.98 65.72,64.29 58.42,64.29 | 58.42,64.29 51.12,64.29 | 51.12,64.29 43.5,64.29 | 43.5,64.29 35.24,64.29 | 35.24,64.29 27.94,64.29 | 27.94,64.29 20.32,64.29 | 20.32,64.29 14.61,64.29 JP13.2 | JP12.2 20.32,64.29 | JP11.2 27.94,64.29 | JP10.2 35.56,63.98 35.24,64.29 | JP9.2 43.18,63.98 43.5,64.29 | JP8.2 50.8,63.98 51.12,64.29 | JP7.2 58.42,64.29 | IC8.9 25.08,41.91 25.72,42.55 30.16,46.99 37.62,46.99 41.75,51.12 56.52,51.12 60.64,55.24 66.67,55.24 67.63,56.2 67.63,61.59 66.67,62.55
  pour Bottom (isolate 0.406): 0,64.77 68.58,64.77 68.58,0 0,0
  pour Top (isolate 0.406, rank 2): 68.58,64.77 0,64.77 0,0 68.58,0
IN1
  Top 0.305: IC1.37 50.06,38.95 52.07,40.96
  Top 0.406: RN1.9 47.47,55.88 52.07,55.88 | 52.07,55.88 62.07,55.88 JP4.1 | 52.07,40.96 52.07,55.88
IN2
  Top 0.305: IC1.38 49.56,39.24 51.28,40.96
  Top 0.406: 44.77,56.04 46.35,57.63 49.69,57.63 50.32,58.26 56.83,58.26 JP7.1 | 51.28,40.96 51.28,50.96 48.42,53.82 46.67,53.82 RN1.8
  Top 0.61: RN1.8 44.77,56.04
IN3
  Top 0.305: IC1.39 49.06,39.53 50.48,40.96
  Top 0.406: JP8.1 49.37,58.42 44.93,58.42 RN1.7 42.23,55.4 44.61,53.02 48.1,53.02 50.48,50.64 50.48,40.96
IN4
  Top 0.305: IC1.40 48.56,39.83 49.69,40.96
  Top 0.406: JP9.1 39.69,56.36 RN1.6 43.02,52.23 47.78,52.23 49.69,50.32 49.69,40.96
IN5
  Top 0.305: IC1.41 48.06,40.12 48.9,40.96
  Top 0.406: JP10.1 37.15,59.85 RN1.5 41.27,51.44 47.47,51.44 48.9,50.01 48.9,40.96
IN6
  Top 0.305: IC1.42 47.56,40.41 48.1,40.96
  Top 0.406: JP11.1 30.48,59.85 RN1.4 39.69,50.64 47.15,50.64 48.1,49.69 48.1,40.96
IN7
  Top 0.305: IC1.43 47.06,40.71 47.31,40.96
  Top 0.406: JP12.1 21.27,59.85 22.7,58.42 29.37,58.42 RN1.3 37.94,49.85 46.83,49.85 47.31,49.37 47.31,40.96
IN8
  Top 0.305: IC1.45 46.06,41.73 45.4,42.39 44.77,42.39
  Top 0.406: JP13.1 13.65,59.85 15.88,57.63 27.62,57.63 RN1.2 36.2,49.05 44.13,49.05 44.45,48.74 44.45,42.7 44.77,42.39
INT
  Top 0.305: U$1.36 51.8,16.88 54.93,20 54.93,21.59 | 54.93,21.59 53.18,23.34 53.18,29.21 51.96,30.43 IC1.25 | 54.93,21.59 SV1.1
IPK
  Top 0.406: U$6.7 U$6.8 U$6.1 17.14,33.4 R28.2 R29.2 R27.2
IR  (via drill 0.6 pad 1.78)  (1 unrouted)
  Top 0.305: IC1.22 49.06,26.03 49.21,25.88 49.21,23.81 48.9,23.5 42.07,23.5 41.59,23.02 41.59,22.54 v41.27,22.07
  Top 0.406: JP16.2 15.14,47.62 R20.2
  Bottom 0.406: v41.27,22.07 41.27,21.27 40.32,20.32 31.11,20.32 26.67,24.77 26.67,30.8 21.27,36.2 | 21.27,39.37 13.02,39.37 10.79,41.59 10.79,46.04 12.38,47.62 JP16.2
LED
  Top 0.305: IC1.32 57.74,33.93 58.26,34.45 64.67,34.45 R38.2
LED_G
  Top 0.406: RJ1.G- 3.59,8.16 2.54,8.26 1.27,6.99 1.27,4.45 4.29,1.43 56.98,1.43 R7.2
LED_Y
  Top 0.406: RJ1.Y- 0.48,14.1 0.48,3.81 3.81,0.48 58.57,0.48 R4.2
MISO
  Top 0.305: U$1.34 52.39,15.88 56.2,19.68 59.69,19.68 60.01,20 60.01,21.91 58.74,23.18 SV1.4 | IC1.27 54.77,31.43 56.2,30 56.2,26.04 56.52,25.72 58.1,25.72 58.74,25.08 58.74,24.45
  Top 0.406: SV1.4 58.74,24.45
MOSI  (1 unrouted)
  Top 0.305: U$1.35 52.1,16.38 56.04,20.32 57.15,20.32 57.47,20.64 57.47,22.86 SV1.2 55.56,24.77 55.56,25.88 55.72,26.04 55.72,28.26 55.4,28.57 55.4,29.21 | IC1.28 55.23,31.93 57.47,29.69 57.47,29.37 57.15,29.37 56.99,29.21
N$1
  Top 0.406: C3.1 18.73,12.54 18.41,12.86 15.56,12.86 15.24,12.54 15.24,11.59 RJ1.RD+
N$2
  Top 0.406: RJ1.RD- 18.52,14.13 C2.1
N$3
  Bottom 0.406: IC8.18 35.24,50.32 35.56,50.64 39.69,50.64 41.27,52.23 55.88,52.23 JP4.3
N$4
  cutout Bottom: 60.33,19.05 65.72,19.05 65.72,6.67 60.33,6.67
  cutout Bottom: 0,64.77 9.21,64.77 9.21,35.24 0,35.24
  cutout Bottom: 0,34.92 11.43,34.92 11.43,23.81 0,23.81
N$5
  Bottom 0.406: IC8.17 33.97,50.32 35.24,51.59 39.37,51.59 40.96,53.18 49.21,53.18 JP7.3
N$6
  Top 0.305: R2.1 42.86,10 44.13,11.27 44.13,11.91 43.66,12.38 U$1.10
N$7
  Top 0.305: R2.2 R3.1
N$8
  Top 0.305: C15.1 50.3,6.7 48.74,8.25 U$1.22
N$9
  Top 0.305: U$1.20 47.74,8.3 48.9,7.14 48.9,5.17 49.78,4.29
  Top 0.406: C14.+ 49.78,4.29
N$10
  Top 0.305: U$1.31 53.27,14.38 55.88,16.98 R12.1
  Top 0.406: C17.2 Q1.2 61.28,16.98 R12.1
N$11
  Bottom 0.406: IC8.16 32.7,50.32 34.92,52.55 39.05,52.55 40.96,54.45 40.96,57.31 41.59,57.94 46.35,57.94 JP8.3
N$12
  Top 0.305: U$1.38 49.24,19.39 50.48,20.64 R5.2
N$13
  Bottom 0.406: IC8.15 31.43,50.32 34.61,53.5 37.78,53.5 38.42,54.13 38.42,57.63 JP9.3
N$14
  Top 0.305: U$1.27 52.23,12.38 52.55,12.06
  Top 0.406: R4.1 60.48,5.56 58.42,7.62 56.99,7.62 52.55,12.06
N$15
  Top 0.305: U$1.41 47.74,19.57 46.67,20.64 R11.2
N$16
  Top 0.305: U$1.40 48.24,20.6 R10.2
N$17
  Top 0.305: U$1.25 51.17,8.99
  Top 0.406: 51.17,8.99 52.7,7.46 55.72,7.46 R7.1
N$18
  Top 0.305: U$1.39 48.74,19.69 49.21,20.16 R9.2
N$19
  Top 0.305: U$1.23 49.24,8.7 50.16,7.78 51.12,7.78
  Top 0.406: 51.12,7.78 52.07,6.83 52.7,6.19 R8.2
N$20
  Top 0.305: U$1.42 47.24,19.28 46.99,19.53 46.51,19.53 45.4,20.64 R6.2
N$21
  Top 0.305: U$1.30 53.57,13.88 54.45,14.76 | 62.23,11.27 C16.2
  Top 0.406: 54.45,14.76 57.47,14.76 | 62.23,11.27 61.28,12.22 61.28,13.02 59.53,14.76 57.47,14.76 | R12.2 57.47,14.76 | Q1.1 C16.2
N$22
  cutout Top (isolate 0.406): 44.13,36.67 50.8,36.67 50.8,30 44.13,30
  cutout Top (isolate 0.406): 43.81,17.3 50.48,17.3 50.48,10.64 43.81,10.64
  cutout Top (isolate 0.406): 9.21,17.62 18.1,17.62 18.1,3.97 9.21,3.97
N$23
  Bottom 0.406: IC8.14 30.16,50.32 33.34,53.5 33.34,59.53 JP10.3
N$24
  Bottom 0.406: IC8.13 28.89,50.32 25.4,53.82 JP11.3
N$25
  Bottom 0.406: IC8.12 27.62,50.32 24.92,53.02 19.68,53.02 17.78,54.93 JP12.3
N$26
  Top 0.406: R38.1 LED2.C
N$27
  cutout Bottom: 0,20.95 18.73,20.95 18.73,3.49 0,3.49
N$28
  Top 0.305: U$1.37 49.9,18.31 R26.2
N$29
  Bottom 0.406: IC8.11 26.35,50.32 24.45,52.23 17.78,52.23 JP13.3
N$30
  cutout Top: 18.1,33.66 21.91,33.66 21.91,28.89 18.1,28.89
  cutout Top: 17.46,26.67 21.27,26.67 21.27,23.81 17.46,23.81
N$31
  Top 0.406: JP2.2 19.05,47.62 20.32,46.35 24.23,46.35 25.18,45.4 R23.1
N$32
  Top 0.406: JP14.2 25.18,47.62 R31.1
N$49
  Top 0.406: R14.2 20.38,10.53 R19.2 18.26,10.47 17.14,11.59 RJ1.P4 15.24,10.32 15.24,9.37 14.92,9.05 12.7,9.05 12.06,8.41 C11.1 11.96,6.61 13.65,4.92 R17.1
N$51
  Top 0.406: U$6.2 19.37,31.91 20.95,30.32 20.95,26 D3.C 21.72,21.88 L1.1
N$56
  Top 0.406: U$6.3 14.92,30.64 C10.1
N$57
  Top 0.406: 12.38,35.4 C28.+
  Top 0.61: F1.1A 0.95,35.15 0.95,25.88 1.91,24.92 6.83,24.92 9.45,27.55 J1.1 9.45,31.83 C28.+ | C29.1 12.38,35.4
N$64
  Top 0.305: IC1.44 46.56,43.14 45.72,43.98
  Top 0.406: JP1.2 45.72,44.61 45.72,43.98 45.72,43.97 45.87,44.13 R34.1
N$66
  Top 0.406: C1.1 RJ1.P5 13.97,13.18 15.24,14.45 15.24,15.08 15.56,15.4 17.78,15.4 18.57,16.19 R15.1 23.43,16.19 23.43,17.14 R22.1
OUT1  (via drill 0.6 pad 1.78)
  Top 0.305: IC1.4 41.89,34.43 v41.2,33.73
  Bottom 0.406: v41.2,33.73 35.4,39.53 35.29,39.26 IC8.1
OUT2  (via drill 0.6 pad 1.78)
  Top 0.305: v40.01,24.13 40.8,24.13 41.59,24.92 45.88,24.92 47.56,26.6 IC1.19
  Bottom 0.406: v40.01,24.13 40.01,25.4 34.77,30.64 34.77,37.31 33.97,38.1 IC8.2
OUT3  (via drill 0.6 pad 1.78)
  Top 0.305: v39.05,22.07 38.73,22.38 38.73,25.08 39.05,25.4 45.56,25.4 47.06,26.9 IC1.18
  Bottom 0.406: v39.05,22.07 38.73,22.38 38.73,25.56 33.97,30.32 33.97,36.99 32.7,38.26 IC8.3
OUT4  (via drill 0.6 pad 1.78)
  Top 0.305: v37.47,24.13 37.47,24.61 38.73,25.88 45.24,25.88 46.56,27.19 IC1.17
  Bottom 0.406: v37.47,24.13 37.47,25.72 33.18,30 33.18,36.51 31.43,38.26 IC8.4
OUT5  (via drill 0.6 pad 1.78)
  Top 0.305: v36.83,22.07 36.2,22.7 36.2,25.08 37.47,26.35 44.93,26.35 46.06,27.48 IC1.16
  Bottom 0.406: v36.83,22.07 36.2,22.7 36.2,25.88 32.38,29.69 32.38,36.04 30.16,38.26 IC8.5
OUT6  (via drill 0.6 pad 1.78)
  Top 0.305: v34.92,24.13 34.92,24.61 37.15,26.83 44.61,26.83 45.56,27.78 IC1.15
  Bottom 0.406: v34.92,24.13 34.92,26.04 31.59,29.37 31.59,35.56 28.89,38.26 IC8.6
OUT7  (via drill 0.6 pad 1.78)
  Top 0.305: v34.61,22.07 33.66,23.02 33.66,25.24 35.72,27.3 44.29,27.3 45.06,28.07 IC1.14
  Bottom 0.406: v34.61,22.07 34.61,21.91 33.97,21.27 31.43,21.27 27.62,25.08 IC8.7
OUT8  (via drill 0.6 pad 1.78)
  Top 0.305: IC1.46 45.56,39.69 v44.45,40.8
  Bottom 0.406: v44.45,40.8 44.45,41.12 40.32,45.24 29.84,45.24 26.35,41.75 IC8.8
OW  (via drill 0.6 pad 1.78)
  Top 0.305: IC1.21 48.56,25.38 v47.94,24.77
  Top 0.406: JP15.2 31.11,10.53 R39.2 30.8,11.06 v30.8,16.51
  Bottom 0.406: v47.94,24.77 47.78,24.77 42.23,19.21 33.5,19.21 v30.8,16.51
RST1
  Top 0.305: IC1.7 44.04,32.93 44.45,33.34 44.45,36.04 43.97,36.51 42.07,36.51 R33.2 40.64,37.31
  Top 0.406: PAD1.1 40.48,37.15 R33.2
RX
  Top 0.305: IC1.31 59.37,33.43 | 59.37,33.43 61.66,33.43 JP3.2 | R30.2 59.21,33.59 59.37,33.43
RX+  (via drill 0.6 pad 1.78)
  Top 0.305: U$1.6 37.72,14.38 37.62,14.29
  Top 0.406: C3.2 22.06,12.54 R15.2 23.96,13.34 v24.77,12.54 | v35.24,12.54 35.72,12.38 37.62,14.29
  Bottom 0.406: v24.77,12.54 v35.24,12.54
RX-  (via drill 0.6 pad 1.78)
  Top 0.305: U$1.5 35.67,14.88 v35.24,14.76
  Top 0.406: C2.2 v25.08,14.76 25.08,17.09 R22.2
  Bottom 0.406: v25.08,14.76 v35.24,14.76
SCK  (1 unrouted)
  Top 0.305: U$1.33 52.69,15.38 56.2,18.89 60.17,18.89 61.28,20 SV1.5 60.01,22.86 60.01,25.4 58.26,27.15 56.83,27.15 | IC1.26 52.41,30.93 53.66,29.69 53.66,27.78 54.29,27.15
TX
  Top 0.305: IC1.30 57.08,32.93 59.37,30.64 JP3.1
TX+
  Top 0.305: 14.61,7.14 RJ1.TD+ | 27.02,10.98 27.15,11.11 27.15,15.88 29.21,17.94 40.32,17.94 41.88,16.38 U$1.2
  Top 0.406: 27.02,10.98 23.18,7.14 20.32,7.14 | 20.32,7.14 14.61,7.14 | R19.1 20.32,7.14
TX-
  Top 0.305: 26.25,11.48 26.51,11.75 26.51,16.19 28.89,18.57 40.64,18.57 42.34,16.88 U$1.1
  Top 0.406: 26.25,11.48 23.81,9.05 22.54,9.05 | RJ1.TD- 22.54,9.05 | R14.1 22.33,8.83 22.54,9.05
VCC  (via drill 0.6 pad 1.78)
  Top 0.305: U$1.17 46.24,8.93 46.04,8.73 45.72,8.73 | U$1.21 48.24,10.93 50.19,12.88 U$1.28 54.27,12.88 55.86,11.29 C5.1 | C4.1 39.7,15.38 U$1.4 43.84,15.38 44.13,15.08 44.13,13.49 44.02,13.38 U$1.8 40.21,13.38 C6.1 37.78,13.17 36.83,12.22 | U$1.15 45.24,8.89 45.4,8.73 45.72,8.73 | U$1.11 41.88,11.88 41.27,11.27 41.27,8.41 40.96,8.1 C7.1 | C8.1 45.72,8.73 | IC1.48 43.76,37.36 v42.86,37.94 | v51.75,38.26 51.75,36.19 IC1.36 | IC1.24 50.32,28.73 v51.44,28.73 52.07,28.73 C19.1 | IC1.9 39.39,31.93 C22.1 | C9.1 55.88,3.33 55.72,3.17 | U$1.43 46.74,17.05 46.67,16.99 | 46.35,16.99 46.04,16.99 45.74,17.28 U$1.45 | 46.35,16.99 46.67,16.99 | 46.67,16.99 49.85,16.99 50.48,17.62 | U$1.44 46.24,17.1 46.35,16.99 | R33.1 40.96,39.69 41.04,39.77
  Top 0.406: 28.57,4.92 R17.2 15.46,2.75 14.92,2.22 6.35,2.22 4.76,3.81 4.76,5.71 | 28.57,4.92 36.83,4.92 | 55.72,3.17 54.93,2.38 46.67,2.38 45.72,3.34 45.72,4.35 | C8.1 45.72,4.35 | C7.1 C13.+ | C13.+ | 36.83,12.22 36.83,8.1 | 36.83,8.1 36.83,4.92 | C13.+ 36.83,8.1 | 66.36,29.05 66.36,35.4 64.45,37.31 56.84,37.31 | 66.36,29.05 66.36,24.13 | 66.36,24.13 66.36,8.26 63.66,5.56 | 63.66,5.56 61.91,3.81 56.04,3.81 C9.1 | 56.84,37.31 C18.1 53.02,38.26 v51.75,38.26 | C22.1 37.15,32.86 C23.+ 35.88,32.38 35.24,33.02 32.07,33.02 | 45.72,4.35 37.4,4.35 36.83,4.92 | C19.1 52.07,22.7 R26.1 52.71,22.38 53.66,21.43 53.66,19.84 51.44,17.62 50.48,17.62 | v42.86,37.94 41.04,39.77 40.32,40.48 C20.1 C21.+ 36.2,41.12 | JP1.1 36.51,46.83 36.2,46.51 | 36.2,46.51 36.2,41.12 | 36.2,41.12 32.07,36.99 32.07,33.02 | L1.2 24.77,22.38 R24.1 24.77,25.24 25.72,26.19 29.53,26.19 C24.1 31.88,26.51 32.07,26.38 | 36.2,46.51 RN1.1 26.83,55.56 JP6.2 22.23,55.56 | 56.2,10.64 C5.1 57.47,10.96 C12.+ 58.9,10.32 63.66,5.56 | J2.4 56.83,44.29 56.84,37.31 | C25.1 29,12.77 R39.1 28.57,10.53 JP15.1 28.57,4.92 | LED2.A 66.3,29.11 66.36,29.05 | JP6.1 22.23,55.56 | 32.07,26.38 32.07,33.02 | 22.23,55.56 JP14.3 JP2.3 15.88,50.16 | 15.88,50.16 JP16.3 11.75,50.16 C31.1 | R20.1 15.88,50.16 | SV1.8 66.36,24.13 | 4.76,5.71 4.76,17.78 3.81,18.73 2.76,18.73 RJ1.Y+ | RJ1.G+ 4.67,5.62 4.76,5.71 | C27.+ 32.07,26.38
  Bottom 0.305: v51.75,38.26 51.44,37.94
  Bottom 0.406: v42.86,37.94 51.44,37.94 v51.44,28.73
VCC_12V
  Top 0.406: U$6.6 24.13,30.64 24.77,31.27 24.77,36.99 23.98,37.78 R27.1
  Top 0.61: R27.1 R29.1 R28.1 16.36,37.78 3.49,50.64 F1.2A 3.49,59.85 6.03,62.39 JP13.4 10.16,63.34 11.11,64.29 17.78,64.29 | JP4.4 63.5,63.98 63.18,64.29 55.88,64.29 | 55.88,64.29 48.26,64.29 | 48.26,64.29 40.64,64.29 | 40.64,64.29 33.02,64.29 | 33.02,64.29 25.4,64.29 | 25.4,64.29 17.78,64.29 | JP12.4 17.78,64.29 | JP11.4 25.4,64.29 | JP10.4 33.02,64.29 | JP7.4 55.88,64.29 | JP8.4 48.26,64.29 | JP9.4 40.64,64.29
(copper drawn outside any net)
  shapes: Bottom area x25, Top area x82, Top circle x4

### Text on the board
Bottom: 7 | 0 | V | IR | B | G | V | G | OW